# EAGLE design stlink_v3_tag_connect (EAGLE 9.3.2)
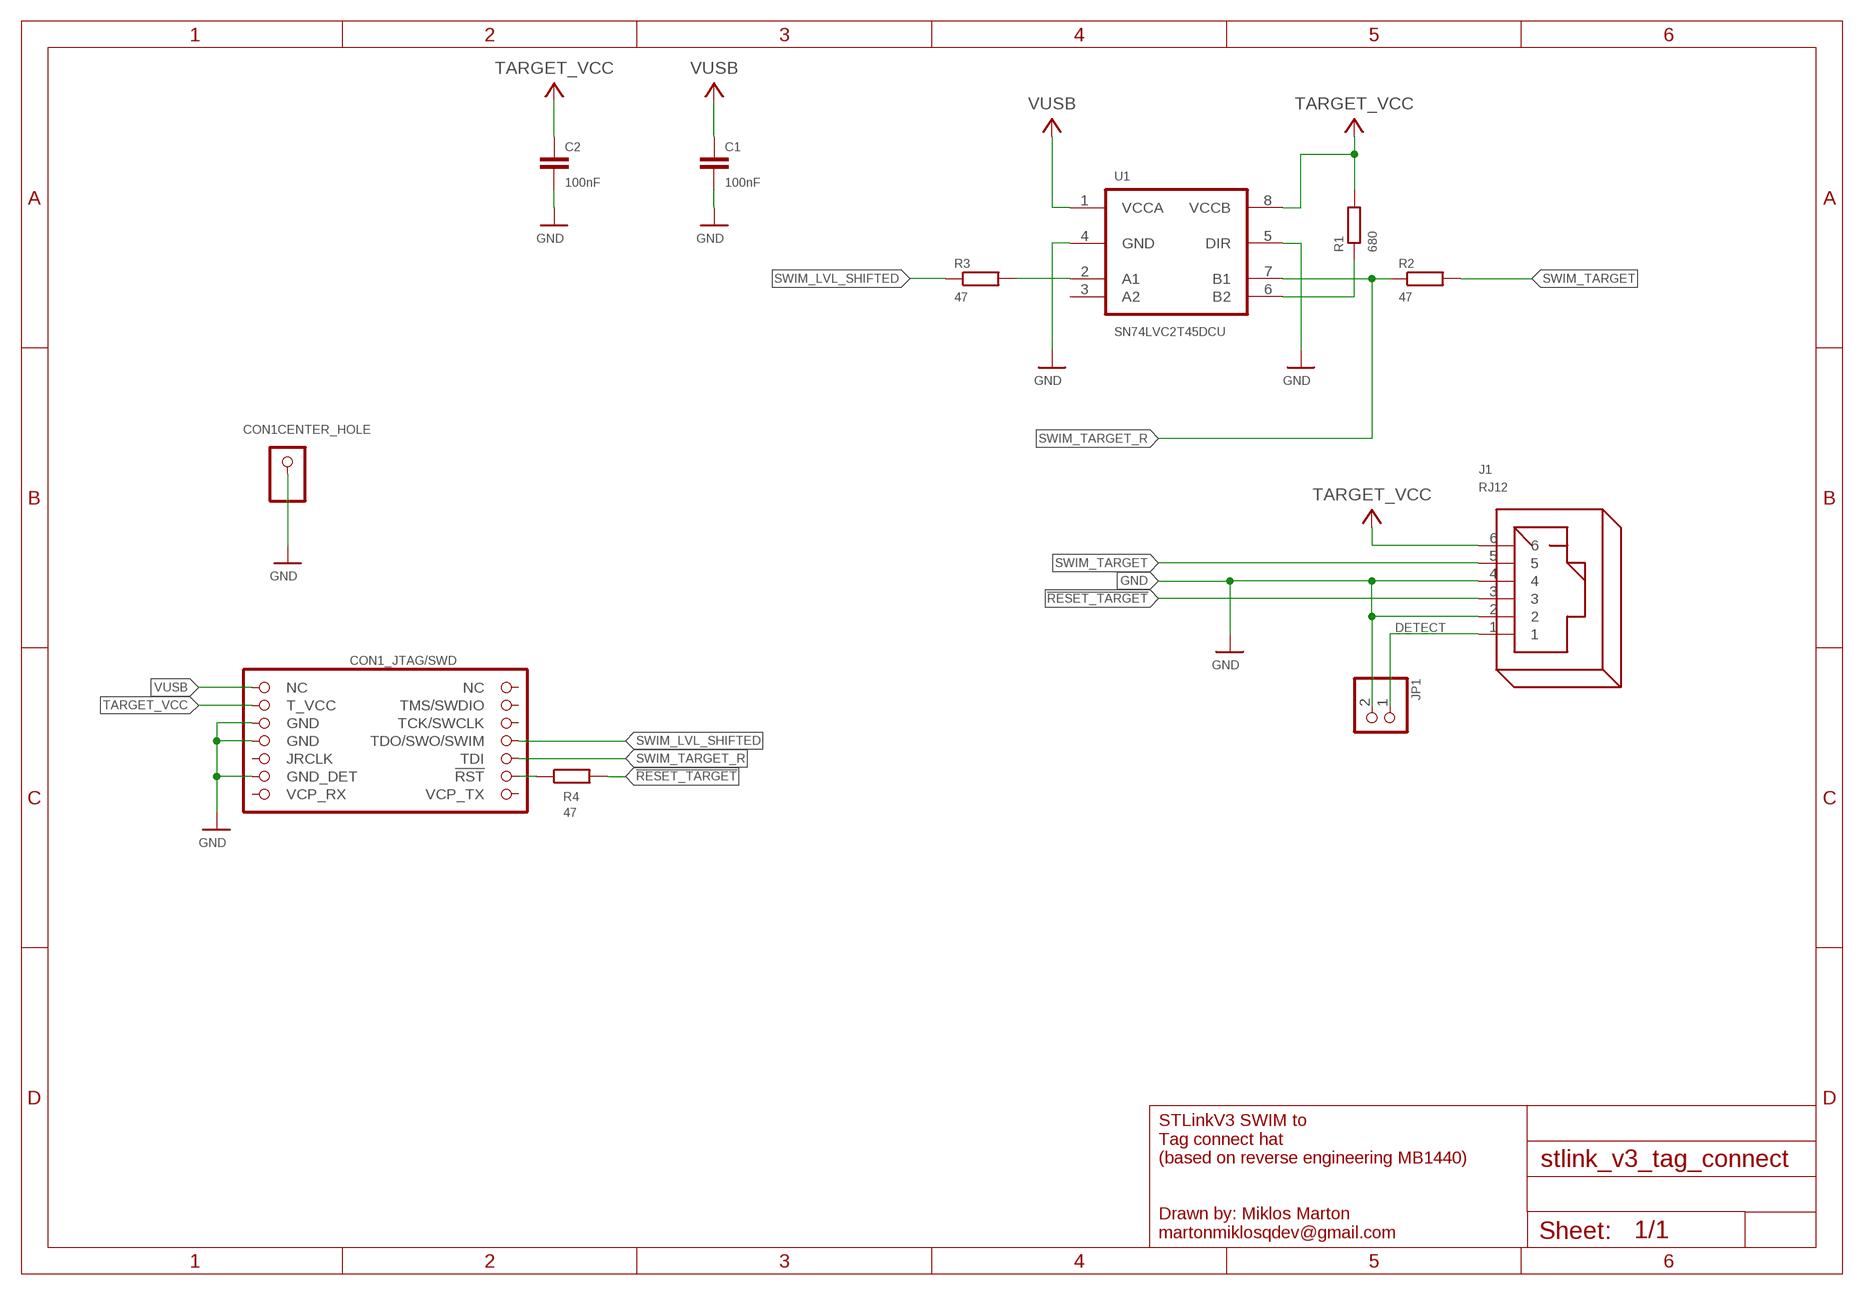
[diagram p0: schematic, sheet 1]

## Parts
C1  100nF  C-EUC0603  [C0603]
C2  100nF  C-EUC0603  [C0603]
CON1  STLINK_V3_HAT_SWD/JTAG_MINIMAL  [STLINKV3_HAT_JTAG_MINIMAL]
J1  RJ12  [RJ12]
JP1  PINHD-1X2  [1X02]
R1  680  R-EU_R0603  [R0603]
R2  47  R-EU_R0603  [R0603]
R3  47  R-EU_R0603  [R0603]
R4  47  R-EU_R0603  [R0603]
U1  SN74LVC2T45DCU  [US8-DCU]

## Nets
!RESET_STLINK: CON1.STDC_14_12(_JTAG/SWD:!RST) R4.1
!RESET_TARGET: J1.3 R4.2
DETECT: J1.1 JP1.1
GND: C1.2 C2.2 CON1.CENTER CON1.STDC_14_5(_JTAG/SWD:GND) CON1.STDC_14_7(_JTAG/SWD:GND) CON1.STDC_14_11(_JTAG/SWD:GND_DET) J1.2 J1.4 JP1.2 U1.4(GND) U1.5(DIR)
N$1: R1.1 U1.6(B2)
SWIM_LVL_SHIFTED: CON1.STDC_14_8(_JTAG/SWD:TDO/SWO/SWIM) R3.1
SWIM_LVL_SHIFTED_R: R3.2 U1.2(A1)
SWIM_TARGET: J1.5 R2.2
SWIM_TARGET_R: CON1.STDC_14_10(_JTAG/SWD:TDI) R2.1 U1.7(B1)
TARGET_VCC: C2.1 CON1.STDC_14_3(_JTAG/SWD:T_VCC) J1.6 R1.2 U1.8(VCCB)
VUSB: C1.1 CON1.STDC_14_1(_JTAG/SWD:NC) U1.1(VCCA)
Unconnected: CON1.STDC_14_2(_JTAG/SWD:NC) CON1.STDC_14_4(_JTAG/SWD:TMS/SWDIO) CON1.STDC_14_6(_JTAG/SWD:TCK/SWCLK) CON1.STDC_14_9(_JTAG/SWD:JRCLK) CON1.STDC_14_13(_JTAG/SWD:VCP_RX) CON1.STDC_14_14(_JTAG/SWD:VCP_TX) U1.3(A2)

## Notes on the sheet
- STLinkV3 SWIM to 
  Tag connect hat
  (based on reverse engineering MB1440)

## Library data of the parts
C1 C2 = rcl:C-EU: CAPACITOR, European symbol
CON1 = stlinkv3:STLINK_V3_HAT_SWD/JTAG_MINIMAL
J1 = con-rj:RJ12: RJ12, RJ14 and RJ25 RJ12, RJ14 and RJ25 jacks side mounted http://www.tycoelectronics.com
JP1 = pinhead:PINHD-1X2: PIN HEADER
R1-R4 = rcl:R-EU_: RESISTOR, European symbol
U1 = 74LV:SN74LVC2T45: DUAL-BIT DUAL-SUPPLY BUS TRANSCEIVER With Configurable Voltage Translation and 3-State Outputs

## Board
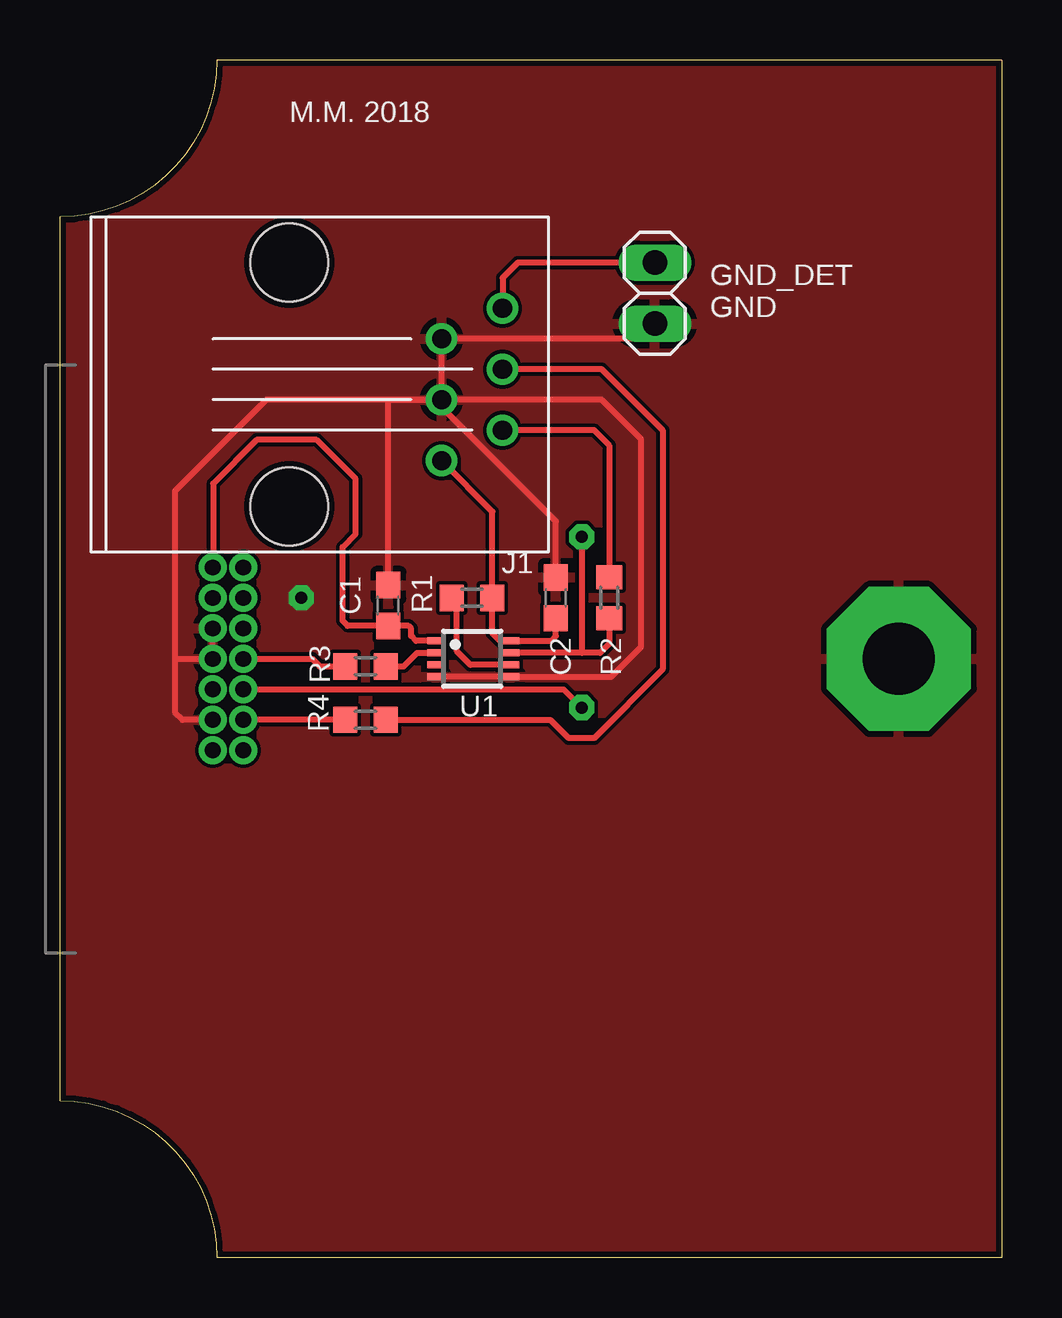
[diagram p1: board, top side]
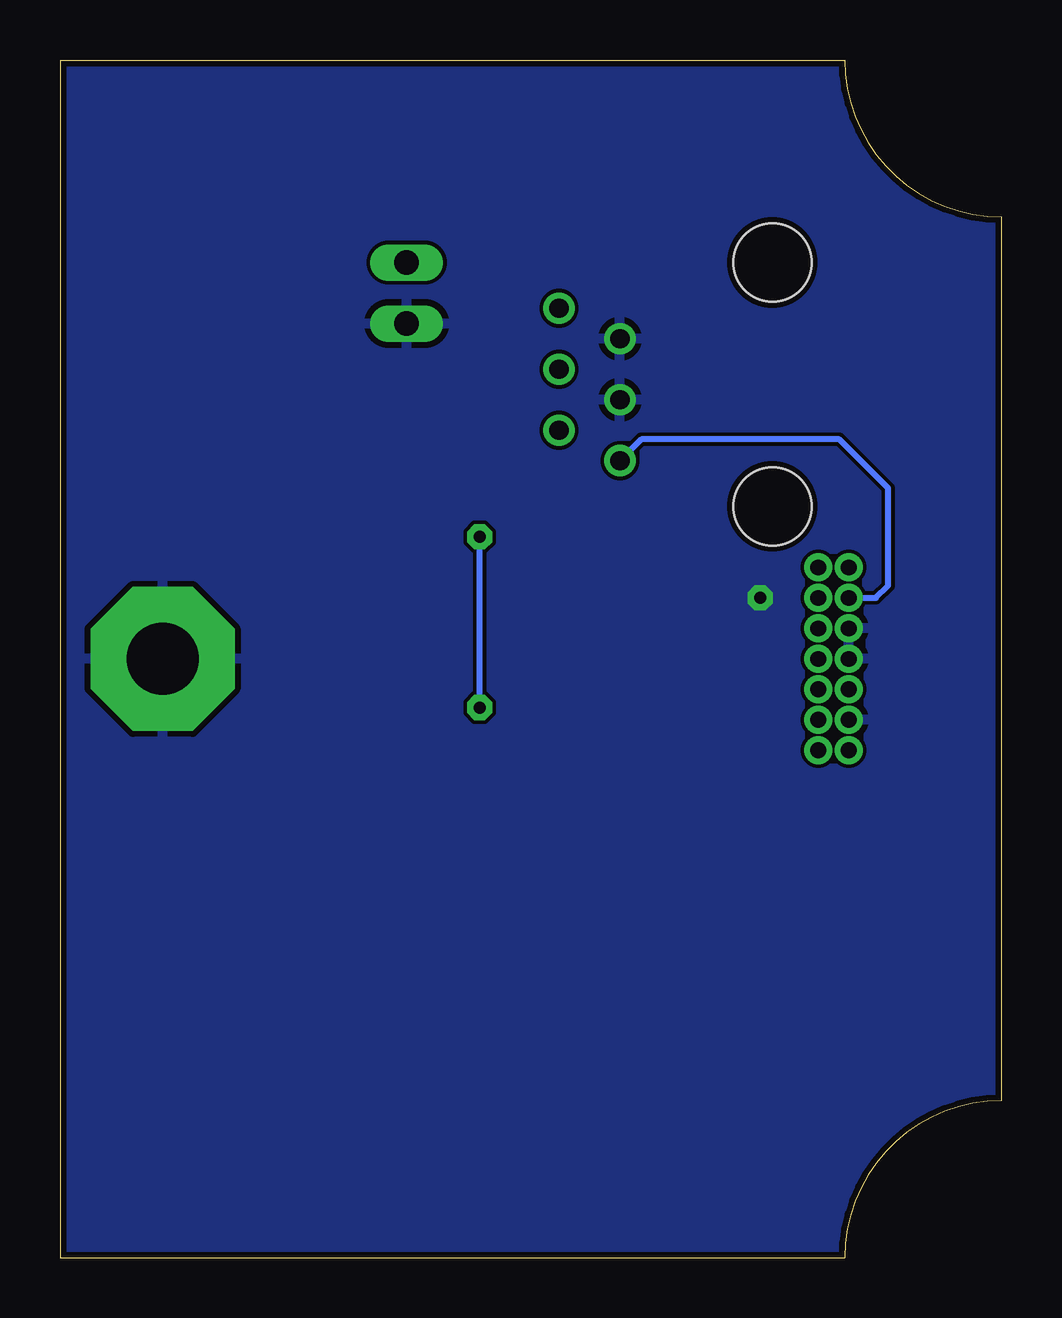
[diagram p2: board, bottom side, seen from below]

Size 39.23 x 49.9 mm. Coordinates in mm from the lower left corner, seen from the top.
Copper layers (1*16): Top 0.035mm / dielectric 1.5mm / Bottom 0.035mm
Design rules "dirt_cheap_dirty_boards.v1": minimum track width 5mil, minimum drill 0.3mm, track to track 6mil, track to pad 6mil, pad to pad 6mil, via to via 6mil, smd to smd 0mil, copper to edge 10mil, drill to drill 10mil, minimum pad ring 10mil, minimum via ring 6mil, stop-mask expansion 2mil, vias tented up to drill 25mil, thermal gap 10mil

### Footprints (pad centres in the part's own frame; a part is rotated, then mirrored left to right if it is on the bottom)
C0603 = smd 1.1 x 1: 1 -0.85,0; 2 0.85,0
STLINKV3_HAT_JTAG_MINIMAL = drill 3 pad 6 octagon: CENTER 0,0 | drill 0.65: STDC_14_1 -28.585,3.81; STDC_14_2 -27.315,3.81; STDC_14_3 -28.585,2.54; STDC_14_4 -27.315,2.54; STDC_14_5 -28.585,1.27; STDC_14_6 -27.315,1.27; STDC_14_7 -28.585,0; STDC_14_8 -27.315,0; STDC_14_9 -28.585,-1.27; STDC_14_10 -27.315,-1.27; STDC_14_11 -28.585,-2.54; STDC_14_12 -27.315,-2.54; STDC_14_13 -28.585,-3.81; STDC_14_14 -27.315,-3.81
RJ12 = drill 0.8: 1 -8.89,-3.175; 2 -6.35,-1.905; 3 -8.89,-0.635; 4 -6.35,0.635; 5 -8.89,1.905; 6 -6.35,3.175 | hole 3.25: 0,-5.08; 0,5.08
1X02 = drill 1.016 long: 1 -1.27,0; 2 1.27,0
R0603 = smd 1 x 1.1: 1 -0.85,0; 2 0.85,0
US8-DCU = smd 0.3 x 0.75: 1 -0.75,-1.5; 2 -0.25,-1.5; 3 0.25,-1.5; 4 0.75,-1.5; 5 0.75,1.6; 6 0.25,1.6; 7 -0.25,1.6; 8 -0.75,1.6

### Placement (x,y rotation side)
C1  13.68,27.17 90 top
C2  20.66,27.49 90 top
CON1  34.95,24.95 0 top
J1  9.55,36.38 180 top
JP1  24.79,40.19 270 top
R1  17.17,27.49 0 top
R2  22.89,27.49 90 top
R3  12.73,24.63 0 top
R4  12.73,22.41 0 top
U1  17.17,24.95 270 top

### Tracks (layer width: path | path; a pad name or v marks a point on that pad's centre or on a via)
!RESET_STLINK
  Top 0.254: R4.1 CON1.STDC_14_12
!RESET_TARGET
  Top 0.254: R4.2 20.43,22.41 21.2,21.65 22.25,21.65 25.11,24.5 25.11,34.48 22.57,37.02 J1.3
DETECT
  Top 0.254: J1.1 18.44,40.83 19.08,41.46 JP1.1
GND  (via drill 0.5 pad 1.05)
  Top 0.254: U1.4 U1.5 22.96,24.2 24.22,25.46 24.22,34.09 22.57,35.74 J1.4 | CON1.STDC_14_5 CON1.STDC_14_7 4.79,24.95 | J1.4 J1.2 24.16,38.28 JP1.2 | C2.2 20.66,30.68 15.9,35.44 J1.4 | C1.2 13.68,35.74 J1.4 | J1.4 8.6,35.74 4.79,31.93 4.79,24.95 | CON1.STDC_14_11 5.11,22.41 4.79,22.73 4.79,24.95
  other vias: 10.06,27.49
  pour Top: 6.54,0 arc90 0,6.54 0,43.36 arc90 6.54,49.9 39.23,49.9 39.23,0
  pour Bottom: 6.54,0 arc90 0,6.54 0,43.36 arc90 6.54,49.9 39.23,49.9 39.23,0
N$1
  Top 0.254: U1.6 17.1,24.7 16.54,25.27 16.54,27.27 R1.1
SWIM_LVL_SHIFTED
  Top 0.254: R3.1 10.82,24.63 10.5,24.95 CON1.STDC_14_8
SWIM_LVL_SHIFTED_R
  Top 0.254: U1.2 14.88,25.2 14.31,24.63 R3.2
SWIM_TARGET
  Top 0.254: R2.2 22.89,33.84 22.25,34.48 J1.5
SWIM_TARGET_R  (via drill 0.5 pad 1.05)
  Top 0.254: 21.74,25.2 22.5,25.2 22.89,25.59 R2.1 | 21.74,25.2 U1.7 | CON1.STDC_14_10 20.98,23.68 v21.74,22.92 | v21.74,30.03 21.74,25.2
  Bottom 0.254: v21.74,22.92 v21.74,30.03
TARGET_VCC
  Top 0.254: C2.1 20.66,25.9 20.46,25.7 U1.8 18.33,25.7 18.02,26 R1.2 18.02,31.09 J1.6
  Bottom 0.254: CON1.STDC_14_3 5.23,27.49 4.72,28 4.72,32.06 6.76,34.09 15.01,34.09 J1.6
VUSB
  Top 0.254: U1.1 14.83,25.7 14.63,25.9 14.63,26.22 14.53,26.32 C1.1 11.99,26.32 11.77,26.54 11.77,29.61 12.32,30.15 12.32,32.45 10.7,34.07 8.19,34.07 6.38,32.25 6.38,28.77 CON1.STDC_14_1

### Text on the board
tNames: M.M. 2018 | GND_DET / GND